# EAGLE schematic charliewatch-norf (EAGLE 7.7.0)
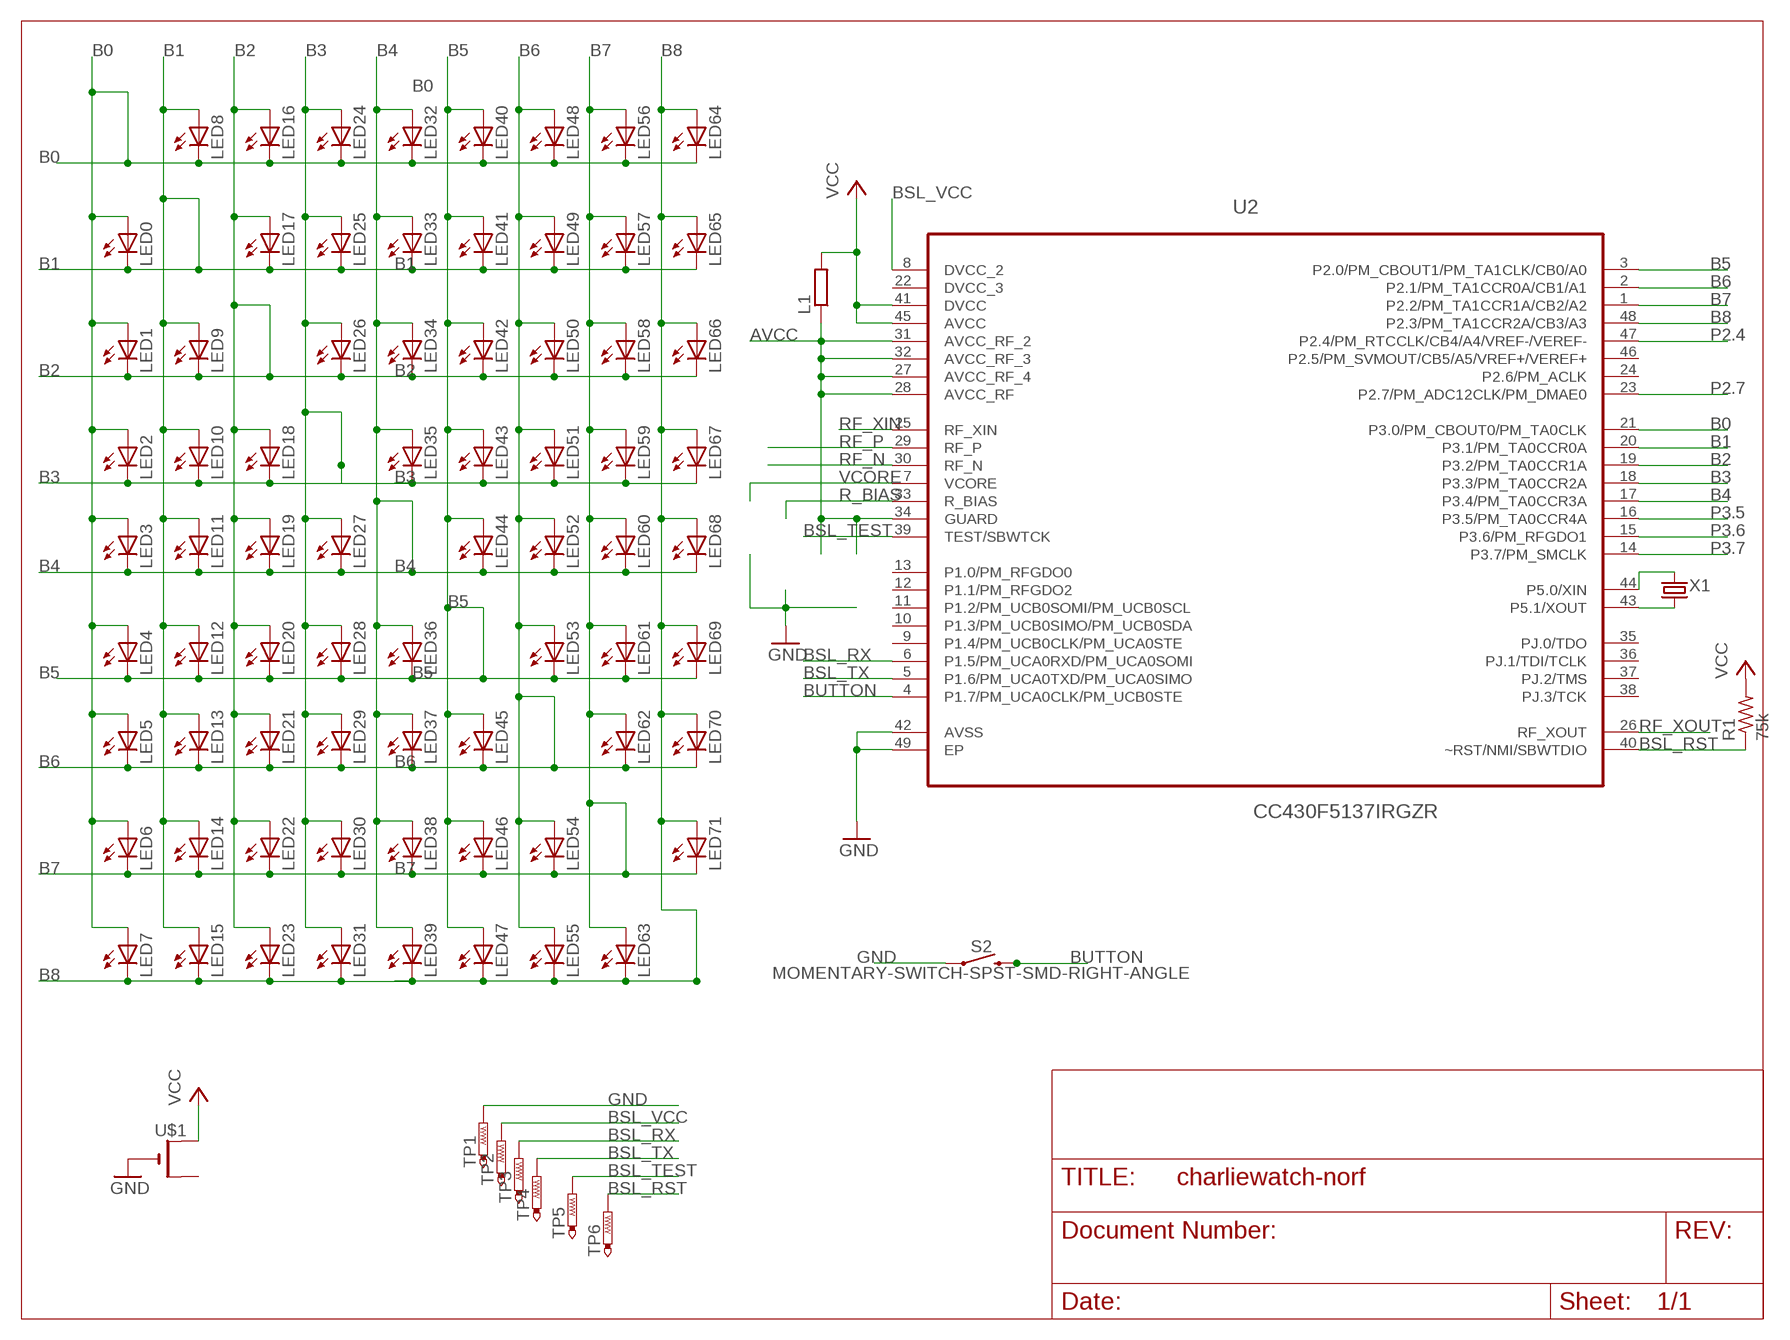
[diagram p0: schematic, sheet 1]

## Parts
L1  R-EU_R0603  [R0603]
LED0  LEDCHIPLED_0603  [CHIPLED_0603]
LED1  LEDCHIPLED_0603  [CHIPLED_0603]
LED2  LEDCHIPLED_0603  [CHIPLED_0603]
LED3  LEDCHIPLED_0603  [CHIPLED_0603]
LED4  LEDCHIPLED_0603  [CHIPLED_0603]
LED5  LEDCHIPLED_0603  [CHIPLED_0603]
LED6  LEDCHIPLED_0603  [CHIPLED_0603]
LED7  LEDCHIPLED_0603  [CHIPLED_0603]
LED8  LEDCHIPLED_0603  [CHIPLED_0603]
LED9  LEDCHIPLED_0603  [CHIPLED_0603]
LED10  LEDCHIPLED_0603  [CHIPLED_0603]
LED11  LEDCHIPLED_0603  [CHIPLED_0603]
LED12  LEDCHIPLED_0603  [CHIPLED_0603]
LED13  LEDCHIPLED_0603  [CHIPLED_0603]
LED14  LEDCHIPLED_0603  [CHIPLED_0603]
LED15  LEDCHIPLED_0603  [CHIPLED_0603]
LED16  LEDCHIPLED_0603  [CHIPLED_0603]
LED17  LEDCHIPLED_0603  [CHIPLED_0603]
LED18  LEDCHIPLED_0603  [CHIPLED_0603]
LED19  LEDCHIPLED_0603  [CHIPLED_0603]
LED20  LEDCHIPLED_0603  [CHIPLED_0603]
LED21  LEDCHIPLED_0603  [CHIPLED_0603]
LED22  LEDCHIPLED_0603  [CHIPLED_0603]
LED23  LEDCHIPLED_0603  [CHIPLED_0603]
LED24  LEDCHIPLED_0603  [CHIPLED_0603]
LED25  LEDCHIPLED_0603  [CHIPLED_0603]
LED26  LEDCHIPLED_0603  [CHIPLED_0603]
LED27  LEDCHIPLED_0603  [CHIPLED_0603]
LED28  LEDCHIPLED_0603  [CHIPLED_0603]
LED29  LEDCHIPLED_0603  [CHIPLED_0603]
LED30  LEDCHIPLED_0603  [CHIPLED_0603]
LED31  LEDCHIPLED_0603  [CHIPLED_0603]
LED32  LEDCHIPLED_0603  [CHIPLED_0603]
LED33  LEDCHIPLED_0603  [CHIPLED_0603]
LED34  LEDCHIPLED_0603  [CHIPLED_0603]
LED35  LEDCHIPLED_0603  [CHIPLED_0603]
LED36  LEDCHIPLED_0603  [CHIPLED_0603]
LED37  LEDCHIPLED_0603  [CHIPLED_0603]
LED38  LEDCHIPLED_0603  [CHIPLED_0603]
LED39  LEDCHIPLED_0603  [CHIPLED_0603]
LED40  LEDCHIPLED_0603  [CHIPLED_0603]
LED41  LEDCHIPLED_0603  [CHIPLED_0603]
LED42  LEDCHIPLED_0603  [CHIPLED_0603]
LED43  LEDCHIPLED_0603  [CHIPLED_0603]
LED44  LEDCHIPLED_0603  [CHIPLED_0603]
LED45  LEDCHIPLED_0603  [CHIPLED_0603]
LED46  LEDCHIPLED_0603  [CHIPLED_0603]
LED47  LEDCHIPLED_0603  [CHIPLED_0603]
LED48  LEDCHIPLED_0603  [CHIPLED_0603]
LED49  LEDCHIPLED_0603  [CHIPLED_0603]
LED50  LEDCHIPLED_0603  [CHIPLED_0603]
LED51  LEDCHIPLED_0603  [CHIPLED_0603]
LED52  LEDCHIPLED_0603  [CHIPLED_0603]
LED53  LEDCHIPLED_0603  [CHIPLED_0603]
LED54  LEDCHIPLED_0603  [CHIPLED_0603]
LED55  LEDCHIPLED_0603  [CHIPLED_0603]
LED56  LEDCHIPLED_0603  [CHIPLED_0603]
LED57  LEDCHIPLED_0603  [CHIPLED_0603]
LED58  LEDCHIPLED_0603  [CHIPLED_0603]
LED59  LEDCHIPLED_0603  [CHIPLED_0603]
LED60  LEDCHIPLED_0603  [CHIPLED_0603]
LED61  LEDCHIPLED_0603  [CHIPLED_0603]
LED62  LEDCHIPLED_0603  [CHIPLED_0603]
LED63  LEDCHIPLED_0603  [CHIPLED_0603]
LED64  LEDCHIPLED_0603  [CHIPLED_0603]
LED65  LEDCHIPLED_0603  [CHIPLED_0603]
LED66  LEDCHIPLED_0603  [CHIPLED_0603]
LED67  LEDCHIPLED_0603  [CHIPLED_0603]
LED68  LEDCHIPLED_0603  [CHIPLED_0603]
LED69  LEDCHIPLED_0603  [CHIPLED_0603]
LED70  LEDCHIPLED_0603  [CHIPLED_0603]
LED71  LEDCHIPLED_0603  [CHIPLED_0603]
R1  75k  R-US_R0402  [R0402]
S2  MOMENTARY-SWITCH-SPST-SMD-RIGHT-ANGLE  [TACTILE_SWITCH_SMD_RIGHT_ANGLE]
TP1  PTR1TP10SQ  [TP10SQ]
TP2  PTR1TP10R  [TP10R]
TP3  PTR1TP10R  [TP10R]
TP4  PTR1TP10R  [TP10R]
TP5  PTR1TP10R  [TP10R]
TP6  PTR1TP10R  [TP10R]
U2  CC430F5137IRGZR  [QFN50P700X700X100-49N]
U$1  CR2032SMT  [CR2032-SMD]
X1  CRYSTALS-NOGND-IQXC-25  [2.0X1.2-2PAD]

## Nets
AVCC: L1.1 U2.27(AVCC_RF_4) U2.28(AVCC_RF) U2.31(AVCC_RF_2) U2.32(AVCC_RF_3) U2.34(GUARD)
B0: LED0.A LED1.A LED2.A LED3.A LED4.A LED5.A LED6.A LED7.A LED8.C LED16.C LED24.C LED32.C LED40.C LED48.C LED56.C LED64.C U2.21(P3.0/PM_CBOUT0/PM_TA0CLK)
B1: LED0.C LED8.A LED9.A LED10.A LED11.A LED12.A LED13.A LED14.A LED15.A LED17.C LED25.C LED33.C LED41.C LED49.C LED57.C LED65.C U2.20(P3.1/PM_TA0CCR0A)
B2: LED1.C LED9.C LED16.A LED17.A LED18.A LED19.A LED20.A LED21.A LED22.A LED23.A LED26.C LED34.C LED42.C LED50.C LED58.C LED66.C U2.19(P3.2/PM_TA0CCR1A)
B3: LED2.C LED10.C LED18.C LED24.A LED25.A LED26.A LED27.A LED28.A LED29.A LED30.A LED31.A LED35.C LED43.C LED51.C LED59.C LED67.C U2.18(P3.3/PM_TA0CCR2A)
B4: LED3.C LED11.C LED19.C LED27.C LED32.A LED33.A LED34.A LED35.A LED36.A LED37.A LED38.A LED39.A LED44.C LED52.C LED60.C LED68.C U2.17(P3.4/PM_TA0CCR3A)
B5: LED4.C LED12.C LED20.C LED28.C LED36.C LED40.A LED41.A LED42.A LED43.A LED44.A LED45.A LED46.A LED47.A LED53.C LED61.C LED69.C U2.3(P2.0/PM_CBOUT1/PM_TA1CLK/CB0/A0)
B6: LED5.C LED13.C LED21.C LED29.C LED37.C LED45.C LED48.A LED49.A LED50.A LED51.A LED52.A LED53.A LED54.A LED55.A LED62.C LED70.C U2.2(P2.1/PM_TA1CCR0A/CB1/A1)
B7: LED6.C LED14.C LED22.C LED30.C LED38.C LED46.C LED54.C LED56.A LED57.A LED58.A LED59.A LED60.A LED61.A LED62.A LED63.A LED71.C U2.1(P2.2/PM_TA1CCR1A/CB2/A2)
B8: LED7.C LED15.C LED23.C LED31.C LED39.C LED47.C LED55.C LED63.C LED64.A LED65.A LED66.A LED67.A LED68.A LED69.A LED70.A LED71.A U2.48(P2.3/PM_TA1CCR2A/CB3/A3)
BSL_RST: R1.1 TP6.TP U2.40(~RST/NMI/SBWTDIO)
BSL_RX: TP3.TP U2.6(P1.5/PM_UCA0RXD/PM_UCA0SOMI)
BSL_TEST: TP5.TP U2.39(TEST/SBWTCK)
BSL_TX: TP4.TP U2.5(P1.6/PM_UCA0TXD/PM_UCA0SIMO)
BSL_VCC: TP2.TP U2.8(DVCC_2)
BUTTON: S2.2 U2.4(P1.7/PM_UCA0CLK/PM_UCB0STE)
GND: S2.1 TP1.TP U2.42(AVSS) U2.49(EP) U$1.-
P2.4: U2.47(P2.4/PM_RTCCLK/CB4/A4/VREF-/VEREF-)
P2.7: U2.23(P2.7/PM_ADC12CLK/PM_DMAE0)
P3.5: U2.16(P3.5/PM_TA0CCR4A)
P3.6: U2.15(P3.6/PM_RFGDO1)
P3.7: U2.14(P3.7/PM_SMCLK)
R_BIAS: U2.33(R_BIAS)
RF_N: U2.30(RF_N)
RF_P: U2.29(RF_P)
RF_XIN: U2.25(RF_XIN)
RF_XOUT: U2.26(RF_XOUT)
VCC: L1.2 R1.2 U2.41(DVCC) U2.45(AVCC) U$1.+$1(+)
VCORE: U2.7(VCORE)
XIN: U2.44(P5.0/XIN) X1.2
XOUT: U2.43(P5.1/XOUT) X1.1
Unconnected: U2.9(P1.4/PM_UCB0CLK/PM_UCA0STE) U2.10(P1.3/PM_UCB0SIMO/PM_UCB0SDA) U2.11(P1.2/PM_UCB0SOMI/PM_UCB0SCL) U2.12(P1.1/PM_RFGDO2) U2.13(P1.0/PM_RFGDO0) U2.24(P2.6/PM_ACLK) U2.35(PJ.0/TDO) U2.36(PJ.1/TDI/TCLK) U2.37(PJ.2/TMS) U2.38(PJ.3/TCK) U2.46(P2.5/PM_SVMOUT/CB5/A5/VREF+/VEREF+) U$1.+$2(+1)

## Power pins joined to a net without a drawn wire
DVCC_3: U2.22(DVCC_3)

## Library data of the parts
L1 = rcl:R-EU_: RESISTOR, European symbol
LED0 LED1-LED71 = led:LED: LED OSRAM: - CHIPLED LG R971, LG N971, LY N971, LG Q971, LY Q971, LO R971, LY R971 LH N974, LH R974 LS Q976, LO Q976, LY Q976 LO Q996 - Hyper CHIPLED LW Q18S LB Q993, LB Q99A, LB R99A - SideLED LS A670, LO A670, LY A670, LG A670, LP A670 LB A673, LV A673, LT A673, LW A673 LH A674 LY A675 LS A676, LA A676, LO A676, LY A676, LW A676 LS A679, LY A679, LG A679 - Hyper Micro SIDELED® LS Y876, LA Y876, LO Y876, LY Y876 LT Y87S - SmartLED LW L88C, LW L88S LB L89C, LB L89S, LG L890 LS L89K, LO L89K, LY L89K LS L896, LA L896, LO L896, LY L896 - TOPLED LS T670, LO T670, LY T670, LG T670, LP T670 LSG T670, LSP T670, LSY T670, LOP T670, LYG T670 LG T671, LOG T671, LSG T671 LB T673, LV T673, LT T673, LW T673 LH T674 LS T676, LA T676, LO T676, LY T676, LB T676, LH T676, LSB T676, LW T676 LB T67C, LV T67C, LT T67C, LS T67K, LO T67K, LY T67K, LW E67C LS E67B, LA E67B, LO E67B, LY E67B, LB E67C, LV E67C, LT E67C LW T67C LS T679, LY T679, LG T679 LS T770, LO T770, LY T770, LG T770, LP T770 LB T773, LV T773, LT T773, LW T773 LH T774 LS E675, LA E675, LY E675, LS T675 LS T776, LA T776, LO T776, LY T776, LB T776 LHGB T686 LT T68C, LB T68C - Hyper Mini TOPLED® LB M676 - Mini TOPLED Santana® LG M470 LS M47K, LO M47K, LY M47K Source: http://www.osram.convergy.de LUXEON: - LUMILED® LXK2-PW12-R00, LXK2-PW12-S00, LXK2-PW14-U00, LXK2-PW14-V00 LXK2-PM12-R00, LXK2-PM12-S00, LXK2-PM14-U00 LXK2-PE12-Q00, LXK2-PE12-R00, LXK2-PE12-S00, LXK2-PE14-T00, LXK2-PE14-U00 LXK2-PB12-K00, LXK2-PB12-L00, LXK2-PB12-M00, LXK2-PB14-N00, LXK2-PB14-P00, LXK2-PB14-Q00 LXK2-PR12-L00, LXK2-PR12-M00, LXK2-PR14-Q00, LXK2-PR14-R00 LXK2-PD12-Q00, LXK2-PD12-R00, LXK2-PD12-S00 LXK2-PH12-R00, LXK2-PH12-S00 LXK2-PL12-P00, LXK2-PL12-Q00, LXK2-PL12-R00 Source: www.luxeon.com KINGBRIGHT: KA-3528ASYC Source: www.kingbright.com
R1 = rcl:R-US_: RESISTOR, American symbol
S2 = SparkFun-Switches:MOMENTARY-SWITCH-SPST: Momentary Switch (Pushbutton) - SPST Normally-open (NO) SPST momentary switches (buttons, pushbuttons). Variants PTH-12MM - 12mm square, through-hole Momentary Pushbutton Switch - 12mm Square <https://www.sparkfun.com/products/9190> (COM-09190) PTH-6.0MM, PTH-6.0MM-KIT - 6.0mm square, through-hole Mini Pushbutton Switch <https://www.sparkfun.com/products/97> (COM-00097) KIT package intended for soldering kit's - only one side of pads' copper is exposed. PTH-RIGHT-ANGLE-KIT - Right-angle, through-hole Right Angle Tactile Button <https://www.sparkfun.com/products/10791> - Used on SparkFun BigTime Watch Kit <https://www.sparkfun.com/products/11734> SMD-12MM - 12mm square, surface-mount Tactile Button - SMD (12mm) <https://www.sparkfun.com/products/12993> (COM-12993) Used on SparkFun PicoBoard <https://www.sparkfun.com/products/11888> SMD-4.5MM - 4.5mm Square Trackball Switch Used on SparkFun Blackberry Trackballer Breakout <https://www.sparkfun.com/products/13169> SMD-4.6MMX2.8MM - 4.60mm x 2.80mm, surface mount Used on SparkFun SAMD21 Mini Breakout <https://www.sparkfun.com/products/13664> SMD-5.2MM, SMD-5.2-REDUNDANT - 5.2mm square, surface-mount Mini Pushbutton Switch - SMD <https://www.sparkfun.com/products/8720> (COM-08720) Used on Arduino Pro Mini <https://www.sparkfun.com/products/11114> REDUNDANT package connects both switch circuits together SMD-6.0X3.5MM - 6.0 x 3.5mm, surface mount Momentary Reset Switch SMD <https://www.sparkfun.com/products/8229> (COM-08229) SMD-6.2MM-TALL - 6.2mm square, surface mount Tactile Button - SMD (6mm) <https://www.sparkfun.com/products/12992> Used on SparkFun Digital Sandbox <https://www.sparkfun.com/products/12651> SMD-RIGHT-ANGLE - Right-angle, surface mount Used on SparkFun Block for Intel® Edison - Arduino <https://www.sparkfun.com/products/13036>; PROD_ID: COMP-12265
TP1-TP6 = testpad:PTR1: TEST PIN
U2 = Texas Instruments_By_element14_Batch_1:CC430F5137IRGZR: MSP430 SoC with RF Core; MPN: CC430F5137IRGZR; OC_FARNELL: -; OC_NEWARK: 68R5912; PACKAGE: QFN-48; SUPPLIER: TEXAS INSTRUMENTS
U$1 = adafruit:CR2032
X1 = IQD-Frequency-Products:CRYSTALS-NOGND: CRYSTALS CAN NOT GROUNDED

## Net classes
0 default: width 0.102 mm, drill 0.025 mm, clearance 0.025 mm